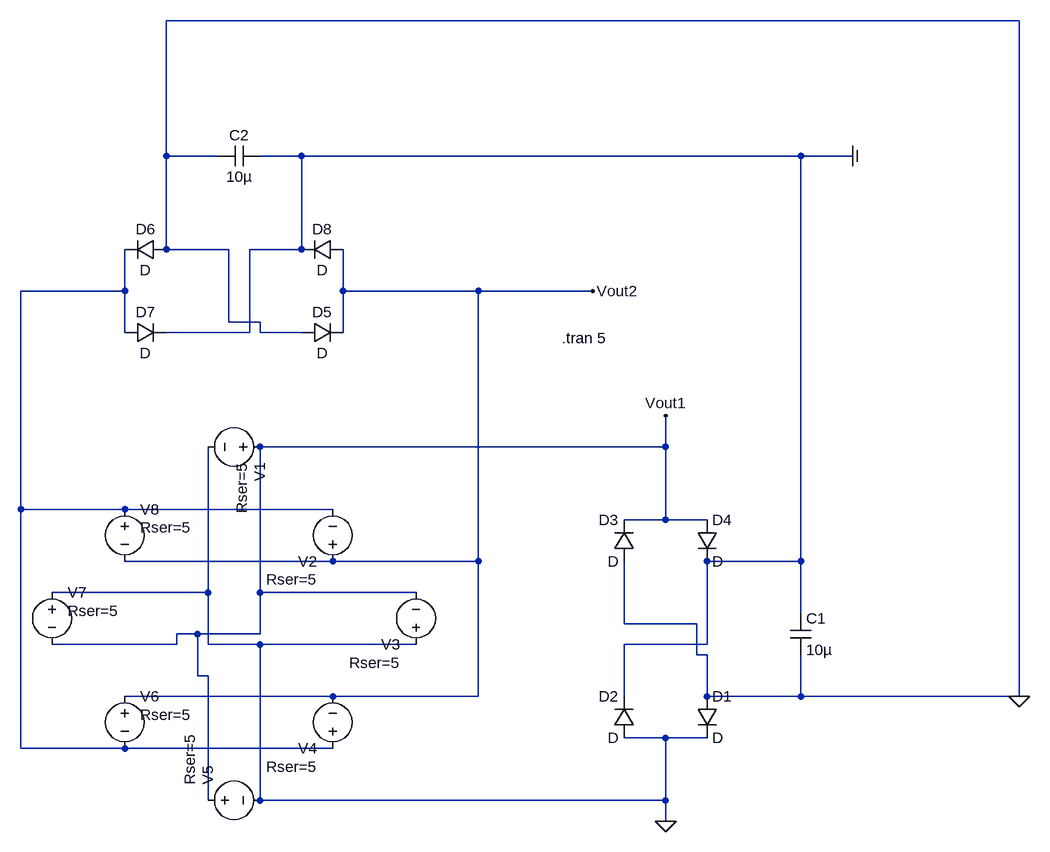
[diagram p0: schematic StatorOutput.asc]
StatorOutput.asc, the LTspice schematic file:
Version 4
SHEET 1 1572 680
WIRE 1552 -640 240 -640
WIRE 240 -432 240 -640
WIRE 320 -432 240 -432
WIRE 448 -432 384 -432
WIRE 1216 -432 448 -432
WIRE 1296 -432 1216 -432
WIRE 240 -288 240 -432
WIRE 336 -288 240 -288
WIRE 448 -288 448 -432
WIRE 448 -288 368 -288
WIRE 176 -224 176 -288
WIRE 176 -224 16 -224
WIRE 512 -224 512 -288
WIRE 720 -224 512 -224
WIRE 896 -224 720 -224
WIRE 336 -176 336 -288
WIRE 384 -176 336 -176
WIRE 176 -160 176 -224
WIRE 368 -160 368 -288
WIRE 368 -160 240 -160
WIRE 384 -160 384 -176
WIRE 448 -160 384 -160
WIRE 512 -160 512 -224
WIRE 1008 16 1008 -32
WIRE 1008 16 384 16
WIRE 16 112 16 -224
WIRE 176 112 16 112
WIRE 496 112 176 112
WIRE 1008 128 1008 16
WIRE 1008 128 944 128
WIRE 1072 128 1008 128
WIRE 496 192 176 192
WIRE 720 192 720 -224
WIRE 720 192 496 192
WIRE 1216 192 1216 -432
WIRE 1216 192 1072 192
WIRE 304 240 304 16
WIRE 304 240 64 240
WIRE 384 240 384 16
WIRE 624 240 384 240
WIRE 1216 272 1216 192
WIRE 944 288 944 192
WIRE 1056 288 944 288
WIRE 288 304 256 304
WIRE 384 304 384 240
WIRE 384 304 288 304
WIRE 256 320 256 304
WIRE 256 320 64 320
WIRE 304 320 304 240
WIRE 384 320 304 320
WIRE 624 320 384 320
WIRE 1072 320 1072 192
WIRE 1072 320 944 320
WIRE 1056 336 1056 288
WIRE 1072 336 1056 336
WIRE 288 368 288 304
WIRE 304 368 288 368
WIRE 496 400 176 400
WIRE 720 400 720 192
WIRE 720 400 496 400
WIRE 944 400 944 320
WIRE 1072 400 1072 336
WIRE 1216 400 1216 336
WIRE 1216 400 1072 400
WIRE 1552 400 1552 -640
WIRE 1552 400 1216 400
WIRE 1008 464 944 464
WIRE 1072 464 1008 464
WIRE 16 480 16 112
WIRE 176 480 16 480
WIRE 496 480 176 480
WIRE 304 560 304 368
WIRE 384 560 384 320
WIRE 1008 560 1008 464
WIRE 1008 560 384 560
WIRE 1008 592 1008 560
FLAG 1552 400 0
FLAG 1296 -432 COM
FLAG 1008 -32 Vout1
FLAG 1008 592 0
FLAG 896 -224 Vout2
SYMBOL voltage 400 16 R90
WINDOW 123 0 0 Left 2
WINDOW 39 24 44 Left 2
WINDOW 3 24 96 Invisible 2
SYMATTR SpiceLine Rser=5
SYMATTR InstName V1
SYMATTR Value SINE(0 5 60 0 0 0)
SYMBOL voltage 496 208 R180
WINDOW 123 0 0 Left 2
WINDOW 39 24 -12 Left 2
WINDOW 3 24 96 Invisible 2
SYMATTR SpiceLine Rser=5
SYMATTR InstName V2
SYMATTR Value SINE(0 5 60 0 0 90)
SYMBOL voltage 624 336 R180
WINDOW 123 0 0 Left 2
WINDOW 39 24 -12 Left 2
WINDOW 3 24 96 Invisible 2
SYMATTR SpiceLine Rser=5
SYMATTR InstName V3
SYMATTR Value SINE(0 5 60 0 0 180)
SYMBOL voltage 496 496 R180
WINDOW 123 0 0 Left 2
WINDOW 39 24 -12 Left 2
WINDOW 3 24 96 Invisible 2
SYMATTR SpiceLine Rser=5
SYMATTR InstName V4
SYMATTR Value SINE(0 5 60 0 0 270)
SYMBOL voltage 288 560 R270
WINDOW 123 0 0 Left 2
WINDOW 39 24 -12 Left 2
WINDOW 3 24 96 Invisible 2
SYMATTR SpiceLine Rser=5
SYMATTR InstName V5
SYMATTR Value SINE(0 5 60 0 0 0)
SYMBOL voltage 176 384 R0
WINDOW 123 0 0 Left 2
WINDOW 39 24 44 Left 2
WINDOW 3 24 96 Invisible 2
SYMATTR SpiceLine Rser=5
SYMATTR InstName V6
SYMATTR Value SINE(0 5 60 0 0 90)
SYMBOL voltage 64 224 R0
WINDOW 123 0 0 Left 2
WINDOW 39 24 44 Left 2
WINDOW 3 24 96 Invisible 2
SYMATTR SpiceLine Rser=5
SYMATTR InstName V7
SYMATTR Value SINE(0 5 60 0 0 180\)
SYMBOL voltage 176 96 R0
WINDOW 123 0 0 Left 2
WINDOW 39 24 44 Left 2
WINDOW 3 24 96 Invisible 2
SYMATTR SpiceLine Rser=5
SYMATTR InstName V8
SYMATTR Value SINE(0 5 60 0 0 270)
SYMBOL diode 1056 400 R0
SYMATTR InstName D1
SYMBOL diode 960 192 R180
WINDOW 0 24 64 Left 2
WINDOW 3 24 0 Left 2
SYMATTR InstName D3
SYMBOL diode 1056 128 R0
SYMATTR InstName D4
SYMBOL diode 960 464 R180
WINDOW 0 24 64 Left 2
WINDOW 3 24 0 Left 2
SYMATTR InstName D2
SYMBOL diode 448 -176 M90
WINDOW 0 0 32 VBottom 2
WINDOW 3 32 32 VTop 2
SYMATTR InstName D5
SYMBOL diode 240 -272 M270
WINDOW 0 32 32 VTop 2
WINDOW 3 0 32 VBottom 2
SYMATTR InstName D6
SYMBOL diode 176 -176 M90
WINDOW 0 0 32 VBottom 2
WINDOW 3 32 32 VTop 2
SYMATTR InstName D7
SYMBOL diode 512 -272 M270
WINDOW 0 32 32 VTop 2
WINDOW 3 0 32 VBottom 2
SYMATTR InstName D8
SYMBOL cap 1200 272 R0
SYMATTR InstName C1
SYMATTR Value 10µ
SYMBOL cap 384 -448 R90
WINDOW 0 0 32 VBottom 2
WINDOW 3 32 32 VTop 2
SYMATTR InstName C2
SYMATTR Value 10µ
TEXT 848 -152 Left 2 !.tran 5

The netlist it stands for:
* StatorOutput.asc
V1 Vout1 0 SINE(0 5 60 0 0 0) Rser=5
V2 Vout2 N001 SINE(0 5 60 0 0 90) Rser=5
V3 0 Vout1 SINE(0 5 60 0 0 180) Rser=5
V4 N001 Vout2 SINE(0 5 60 0 0 270) Rser=5
V5 Vout1 0 SINE(0 5 60 0 0 0) Rser=5
V6 Vout2 N001 SINE(0 5 60 0 0 90) Rser=5
V7 0 Vout1 SINE(0 5 60 0 0 180\) Rser=5
V8 N001 Vout2 SINE(0 5 60 0 0 270) Rser=5
D1 0 0 D
D3 0 Vout1 D
D4 Vout1 COM D
D2 0 COM D
D5 0 Vout2 D
D6 0 N001 D
D7 N001 COM D
D8 Vout2 COM D
C1 COM 0 10µ
C2 COM 0 10µ
.model D D
.lib standard.dio
.tran 5
.backanno
.end